# Altium schematic sheet XM5062_33.SchDoc
size 292 x 193 mm; Author: Power Lin; SheetNumber: 1; SheetTotal: 1; Website: wiki-power.com
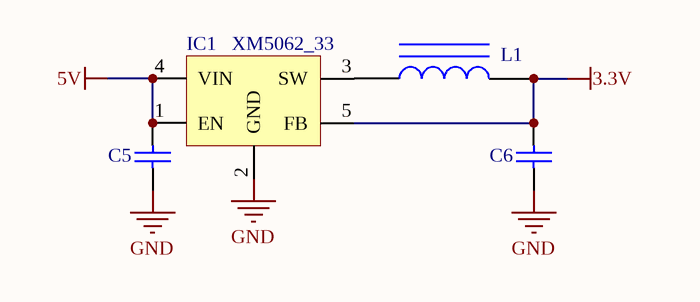
[diagram p0: XM5062_33.SchDoc]

## Parts
C5  4.7uF  [CAP-0603]  (value not drawn)
C6  10uF  [CAP-0603]  (value not drawn)
IC1  XM5062_33  [SOT-23-5]
L1  2.2uH  [XAL6060-103MEB]  (value not drawn)

## Nets
3.3V: C6.2 IC1.5(FB) L1.2
5V: C5.2 IC1.1(EN) IC1.4(VIN)
GND: C5.1 C6.1 IC1.2(GND)
NetIC1_3: IC1.3(SW) L1.1

## Notes on the sheet
- Author
- DocumentName
- ModifiedDate
- ProjectName
- SheetNumber
- SheetTotal
- Website
- Revision

## Library data of the parts
C5 C6 = CAP: 贴片电容; ComponentLink1Description: 供应商链接; ComponentLink1URL: http://www.szlcsc.com/product/details_53938.html; Package: 0402; Supplier: LC; SuppliersPartNumber: C52923
IC1 = XM5062: 降压转换芯片; Manufacturer_Name: TE Connectivity; Manufacturer_Part_Number: 1-1393258-5; Datasheet Link: http://www.te.com/commerce/DocumentDelivery/DDEController?Action=showdoc&DocId=Data+Sheet%7FSR2M%7F1116%7Fpdf%7FEnglish%7FENG_DS_SR2M_1116.pdf%7F1-1393258-5; Height: 25mm
L1 = INDUCTOR: 贴片电感; ComponentLink1Description: 供应商链接; ComponentLink1URL: http://www.szlcsc.com/product/details_33003.html; Package: 0402; Supplier: LC; SuppliersPartNumber: C32041